# Altium schematic sheet Motor.SchDoc
size A4
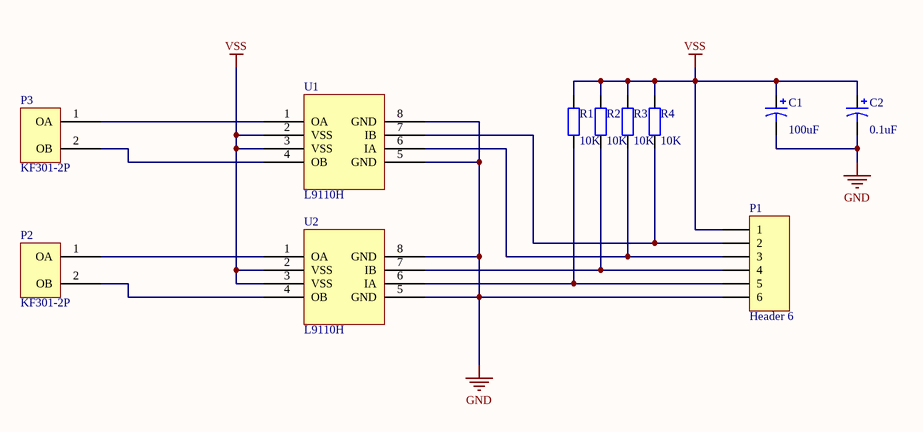
[diagram p0: Motor.SchDoc]

## Parts
C1  value 100uF  [RB7.6-15]  (hidden comment: Cap Pol1)
C2  value 0.1uF  [RB7.6-15]  (hidden comment: Cap Pol1)
P1  Header 6  [HDR1X6]
P2  KF301-2P  [DIP2]
P3  KF301-2P  [DIP2]
R1  value 10K  [AXIAL-0.4]  (hidden comment: Res2)
R2  value 10K  [AXIAL-0.4]  (hidden comment: Res2)
R3  value 10K  [AXIAL-0.4]  (hidden comment: Res2)
R4  value 10K  [AXIAL-0.4]  (hidden comment: Res2)
U1  L9110H  [DIP8]
U2  L9110H  [DIP8]

## Nets
GND: C1.2 C2.2 P1.6 U1.5(GND) U1.8(GND) U2.5(GND) U2.8(GND)
VSS: C1.1 C2.1 P1.1 R1.2 R2.2 R3.2 R4.2 U1.2(VSS) U1.3(VSS) U2.2(VSS) U2.3(VSS)
NetP1_2: P1.2 R4.1 U1.7(IB)
NetP1_3: P1.3 R3.1 U1.6(IA)
NetP1_4: P1.4 R2.1 U2.7(IB)
NetP1_5: P1.5 R1.1 U2.6(IA)
NetP2_1: P2.1(OA) U2.1(OA)
NetP2_2: P2.2(OB) U2.4(OB)
NetP3_1: P3.1(OA) U1.1(OA)
NetP3_2: P3.2(OB) U1.4(OB)

## Library data of the parts
C1 C2 = Cap Pol1: Polarized Capacitor (Radial); Published: 8-Jun-2000; LatestRevisionDate: 17-Jul-2002; LatestRevisionNote: Re-released for DXP Platform.; PackageReference: RB7.6-15; Publisher: Altium Limited; PackageDescription: Polarized Capacitor (Radial); 2 Leads
P1 = Header 6: Header, 6-Pin; LatestRevisionDate: 17-Jul-2002; LatestRevisionNote: Re-released for DXP Platform.; Publisher: Altium Limited
R1-R4 = Res2: Resistor; Published: 8-Jun-2000; LatestRevisionDate: 17-Jul-2002; LatestRevisionNote: Re-released for DXP Platform.; PackageReference: AXIAL-0.4; Publisher: Altium Limited; PackageDescription: Axial Device, Thru-Hole; 2 Leads; 0.4 in Pin Spacing